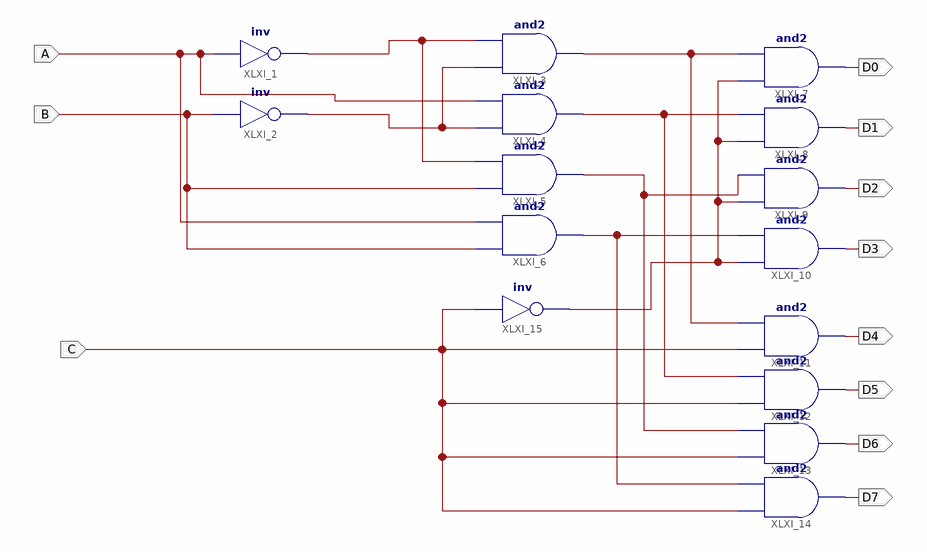
[diagram p0: schematic sheet 1]
// Xilinx ISE schematic Decoder_38_sch.sch (spartan3) as structural Verilog: 15 symbols, 11 ports
module Decoder_38_sch (
  input  A,
  input  B,
  input  C,
  output D0,
  output D1,
  output D2,
  output D3,
  output D4,
  output D5,
  output D6,
  output D7
);

  wire XLXN_4, XLXN_12, XLXN_16, XLXN_21, XLXN_22, XLXN_23, XLXN_24;

  not XLXI_1 (XLXN_12, A);
  not XLXI_2 (XLXN_4, B);
  and XLXI_3 (XLXN_21, XLXN_4, XLXN_12);
  and XLXI_4 (XLXN_22, XLXN_4, A);
  and XLXI_5 (XLXN_23, B, XLXN_12);
  and XLXI_6 (XLXN_24, B, A);
  and XLXI_7 (D0, XLXN_16, XLXN_21);
  and XLXI_8 (D1, XLXN_16, XLXN_22);
  and XLXI_9 (D2, XLXN_16, XLXN_23);
  and XLXI_10 (D3, XLXN_16, XLXN_24);
  and XLXI_11 (D4, C, XLXN_21);
  and XLXI_12 (D5, C, XLXN_22);
  and XLXI_13 (D6, C, XLXN_23);
  and XLXI_14 (D7, C, XLXN_24);
  not XLXI_15 (XLXN_16, C);
endmodule
